# Altium schematic sheet Regulador.SchDoc: CONTROLADORA AIRPOPCORN
size A3; DocumentNumber: 10.00.0025; SheetNumber: 15; SheetTotal: 16
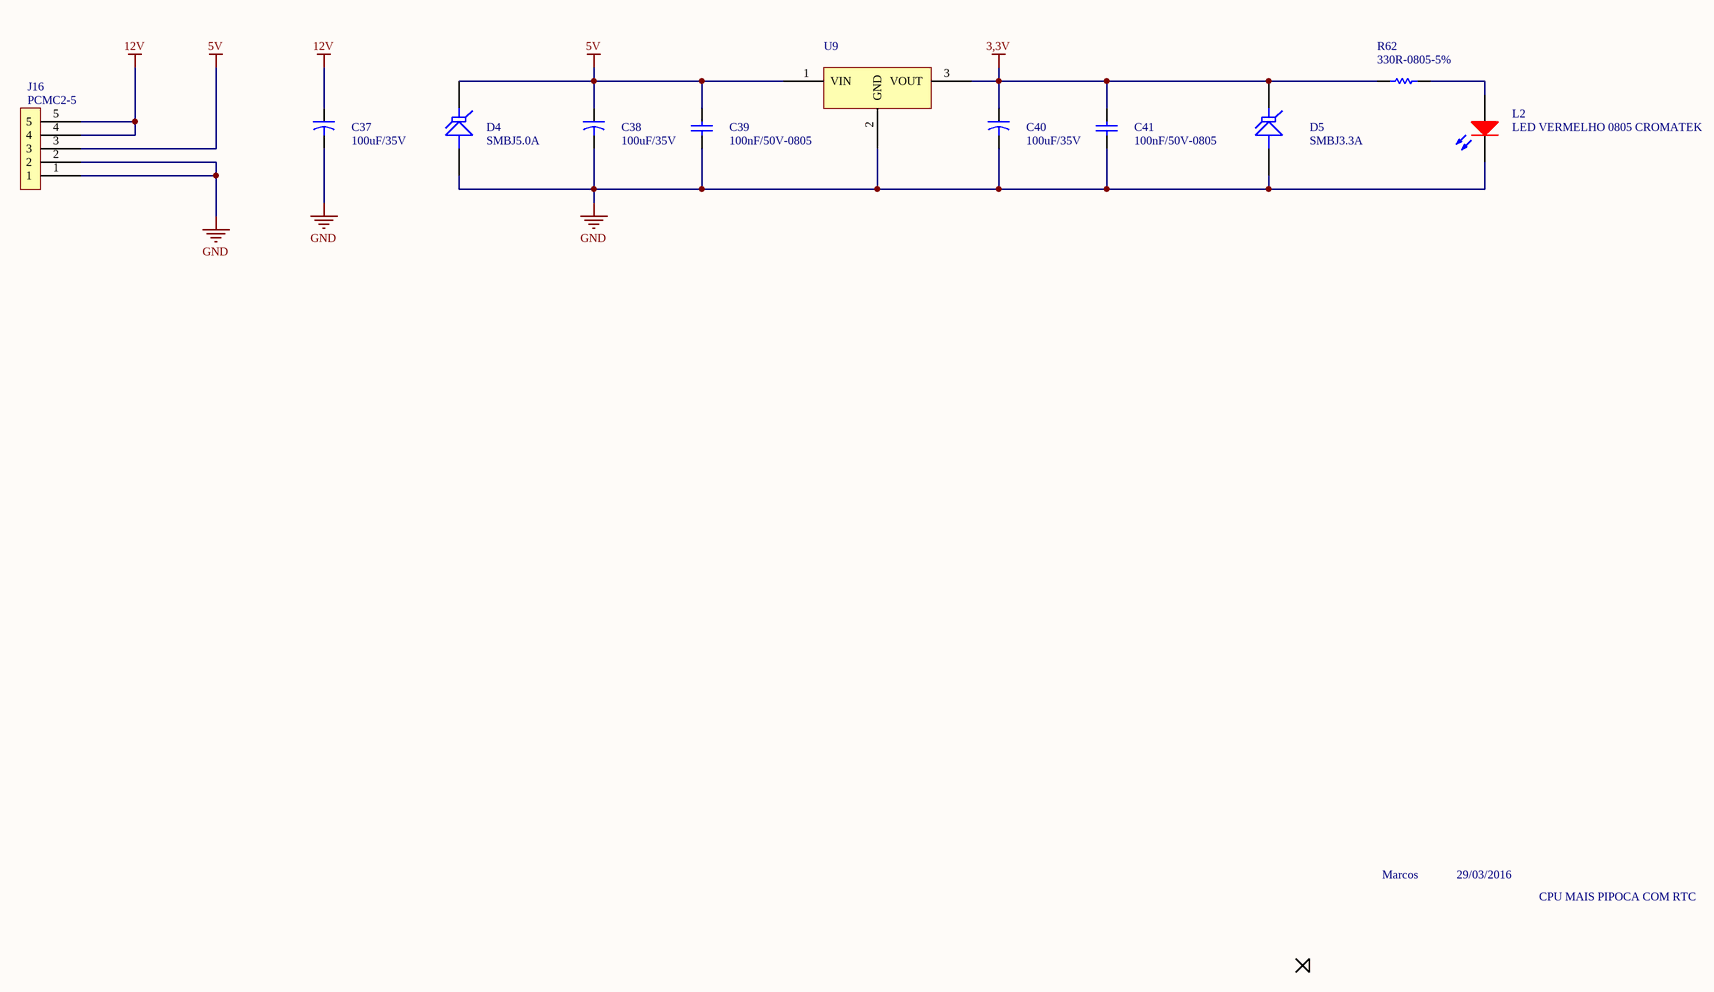
[diagram p0: Regulador.SchDoc]

## Parts
C37  100uF/35V  [CAP POL 8x12mm]
C38  100uF/35V  [CAP POL 8x12mm]
C39  100nF/50V-0805  [0805-REVISADO O]
C40  100uF/35V  [CAP POL 8x12mm]
C41  100nF/50V-0805  [0805-REVISADO O]
D4  SMBJ5.0A  [SMB/DO214AA-REV]
D5  SMBJ3.3A  [SMB/DO214AA-REV]
J16  PCMC2-5  [PCMC2-5]
L2  LED VERMELHO 0805 CROMATEK  [LED 0805 - REVI]
R62  330R-0805-5%  [0805-REVISADO O]
U9  (no value)  [TO-263_3]

## Nets
3,3V: C40.1 C41.2 D5.2(K) R62.1 U9.3(VOUT)
5V: C38.1 C39.2 D4.2(K) J16.3 U9.1(VIN)
12V: C37.1 J16.4 J16.5
GND: C37.2 C38.2 C39.1 C40.2 C41.1 D4.1(A) D5.1(A) J16.1 J16.2 L2.2(K) U9.2(GND)
NetL2_1: L2.1(A) R62.2

## Notes on the sheet
- Marcos
- 29/03/2016
- CPU MAIS PIPOCA COM RTC
- NOME
- DATA
- PROJETO
- DESCRIÇÃO
- www.quarktee.com.br
- desenho
- verif.
- aprov.
- TAMANHO
- CODIGO
- Todas as informações disponíveis
- não devem ser divulgadas,
- em parte ou todo.
- CIRCUITO IMPRESSO
- MONTAGEM ELETRÔNICA
- A4
- de

## Library data of the parts
C37 C38 C40 = 100uF/50V: ERP: 105.01.003
C39 C41 = 100nF/50-0805-NPO: ERP: 104.11.005
D5 = SMBJ5.0A: ERP: 128.02.002
L2 = LED VERMELHO 0603 SMD: ERP: 124.02.010
R62 = 1K-0805-5%: ERP: 102.11.042
U9 = LM3940IT-3.3-TO220: ERP: 115.01.001
D4 = SMBJ5.0A: ERP: 128.02.002